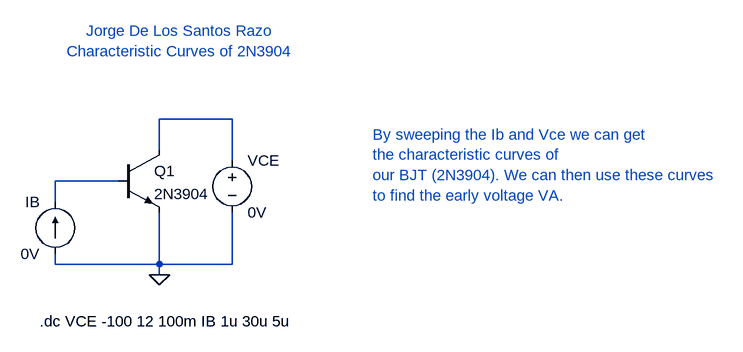
[diagram p0: schematic early-voltage-method-2.asc]
early-voltage-method-2.asc, the LTspice schematic file:
Version 4.1
SHEET 1 1508 680
WIRE 464 64 352 64
WIRE 352 112 352 64
WIRE 464 128 464 64
WIRE 288 160 192 160
WIRE 192 192 192 160
WIRE 192 288 192 272
WIRE 352 288 352 208
WIRE 352 288 192 288
WIRE 464 288 464 208
WIRE 464 288 352 288
WIRE 352 304 352 288
FLAG 352 304 0
SYMBOL npn 288 112 R0
SYMATTR InstName Q1
SYMATTR Value 2N3904
SYMBOL voltage 464 112 R0
SYMATTR InstName VCE
SYMATTR Value 0V
SYMBOL current 192 272 R180
WINDOW 0 24 80 Left 2
WINDOW 3 24 0 Left 2
SYMATTR InstName IB
SYMATTR Value 0V
TEXT 168 376 Left 2 !.dc VCE -100 12 100m IB 1u 30u 5u
TEXT 384 -56 Center 2 ;Jorge De Los Santos Razo\nCharacteristic Curves of 2N3904
TEXT 680 88 Left 2 ;By sweeping the Ib and Vce we can get \nthe characteristic curves of\nour BJT (2N3904). We can then use these curves \nto find the early voltage VA.

The netlist it stands for:
* early-voltage-method-2.asc
Q1 N001 N002 0 0 2N3904
VCE N001 0 0V
IB 0 N002 0V
.model NPN NPN
.model PNP PNP
.lib standard.bjt
.dc VCE -100 12 100m IB 1u 30u 5u
* Jorge De Los Santos Razo
* Characteristic Curves of 2N3904
* By sweeping the Ib and Vce we can get
* the characteristic curves of
* our BJT (2N3904). We can then use these curves
* to find the early voltage VA.
.backanno
.end